# Altium project Controlador de velocidad - Placa fuente.PrjPcb
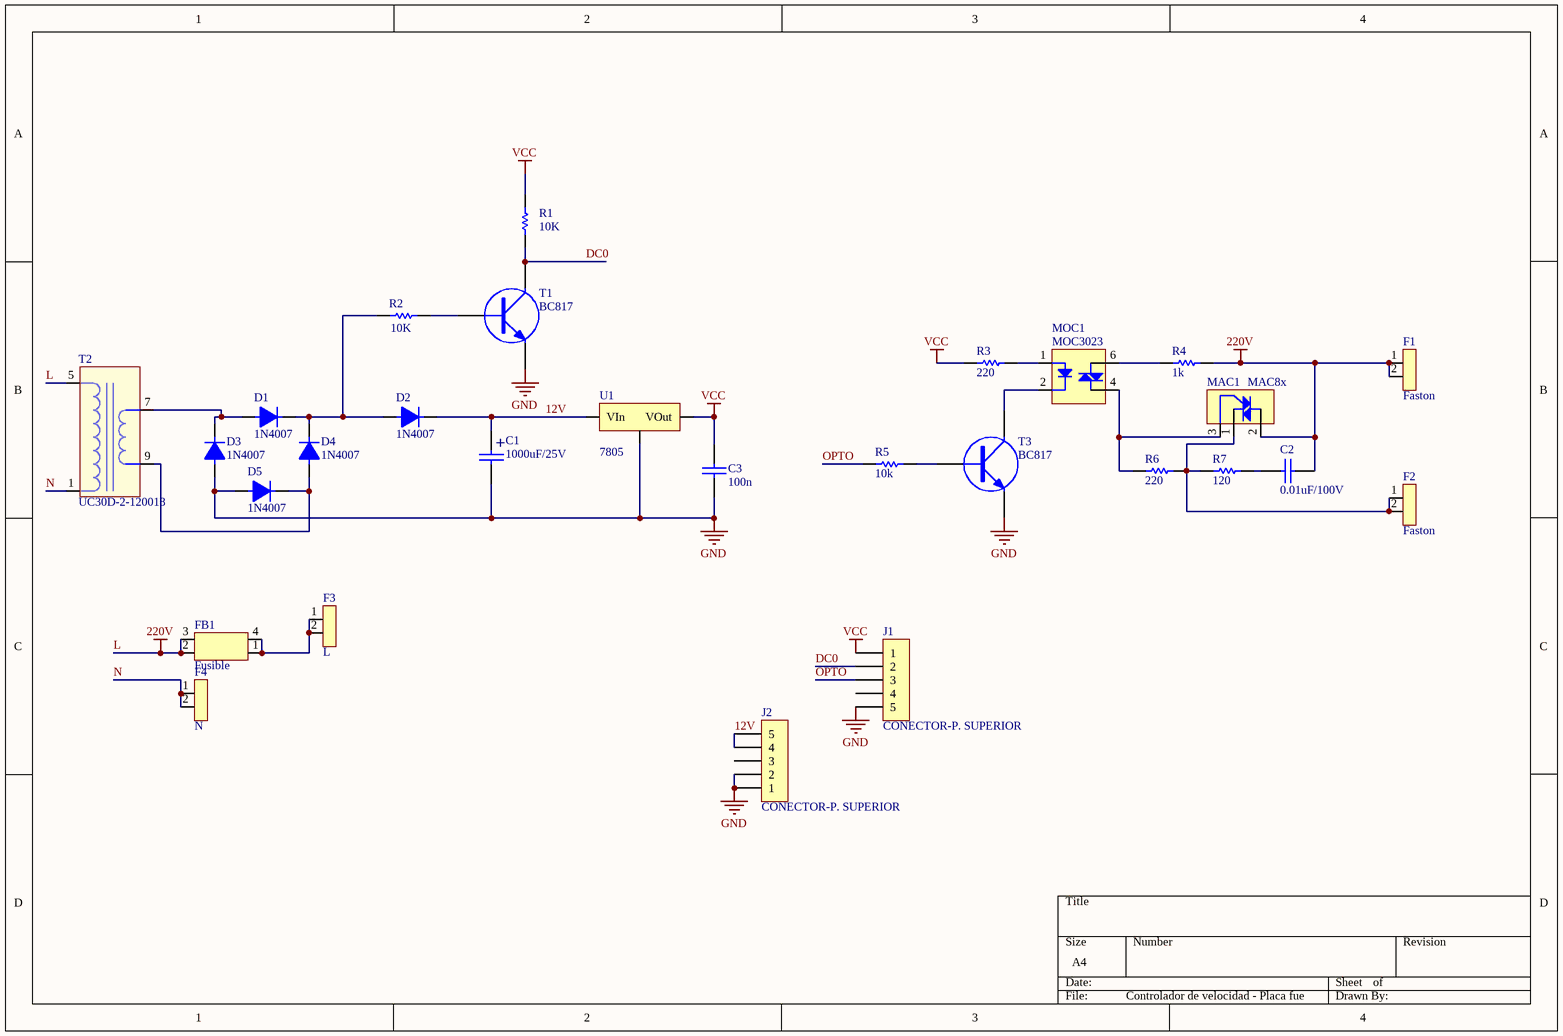
[diagram p0: Controlador de velocidad - Placa fuente.SchDoc]
1 sheet, 28 parts. Net scope: global (net labels, ports and power ports of the same name join across sheets).
Board file: Controlador de velocidad - Placa fuente.PcbDoc

## Sheet Controlador de velocidad - Placa fuente.SchDoc
size A4

### Parts
C1  1000uF/25V  [CAP300RP]
C2  0.01uF/100V  [CAP200]
C3  100n  [CAP200]
D1  1N4007  [DO41]
D2  1N4007  [DO41]
D3  1N4007  [DO41]
D4  1N4007  [DO41]
D5  1N4007  [DO41]
F1  Faston  [Faston_V]
F2  Faston  [Faston_V]
F3  L  [Faston_V]
F4  N  [Faston_V]
FB1  Fusible  [Porta_fuse_2]
J1  CONECTOR-P. SUPERIOR  [SIP5]
J2  CONECTOR-P. SUPERIOR  [SIP5]
MAC1  MAC8x  [TO-220_vert]
MOC1  MOC3023  [4N33]
R1  10K  [0805]
R2  10K  [0805]
R3  220  [0805]
R4  1k  [RES300]
R5  10k  [0805]
R6  220  [RES300]
R7  120  [RES400]
T1  BC817  [SOT23]
T2  UC30D-2-120018  [Trafo_220_12_1]
T3  BC817  [SOT23]
U1  7805  [TO-220 H]

### Nets
GND: C1.2 C3.1 D3.1 D5.1 J1.5 J2.1 J2.2 T1.3(E) T3.3(E) U1.2(GND)
L: C2.1 F1.1 F1.2 FB1.2 FB1.3 MAC1.2(MT2) R4.1 T2.5  [also labelled 220V]
VCC: C3.2 J1.1 R1.2 R3.2 U1.3(VOut)
12V: C1.1 D2.2 J2.4 J2.5 U1.1(VIn)
DC0: J1.2 R1.1 T1.2(C)
N: F4.1 F4.2 T2.1
OPTO: J1.3 R5.1
NetC2_2: C2.2 R7.1
NetD1_1: D1.1 D3.2 T2.7
NetD1_2: D1.2 D2.1 D4.2 R2.1
NetD4_1: D4.1 D5.2 T2.9
NetF2_1: F2.1 F2.2 MAC1.1(MT1) R6.1 R7.2
NetF3_1: F3.1 F3.2 FB1.1 FB1.4
NetMAC1_3: MAC1.3(G) MOC1.4 R6.2
NetMOC1_1: MOC1.1 R3.1
NetMOC1_2: MOC1.2 T3.2(C)
NetMOC1_6: MOC1.6 R4.2
NetR2_2: R2.2 T1.1(B)
NetR5_2: R5.2 T3.1(B)

Not connected (* = marked no-connect by the designer): J1 4; J2 3

### Notes on the sheet
- (in symbol CAPPOL) +

### Library data of the parts
C1 = CAPPOL
C2 C3 = CAP
D1-D5 = DIODO
F1-F4 = FastonX1
FB1 = Porta_fuse_1
J1 J2 = CON5
R1-R7 = RES
T1 T3 = TRANSISTOR NPN
T2 = TRAFO_220_12_1: Text Field1: 30; Text Field2: 40
U1 = 78XX: REGULDOR POSITIVO